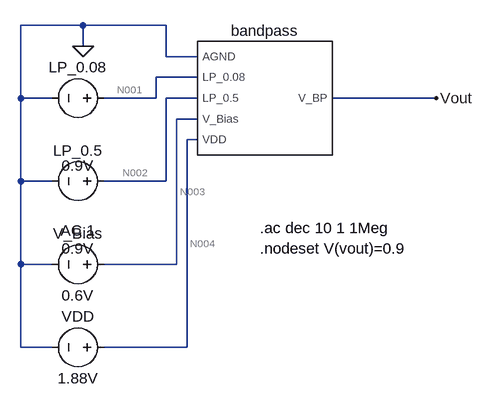
[diagram p0: schematic ota_bandpass_test.asc]
ota_bandpass_test.asc, the LTspice schematic file:
Version 4.1
SHEET 1 880 680
WIRE -64 64 -160 64
WIRE 64 64 -64 64
WIRE -64 96 -64 64
WIRE 64 112 64 64
WIRE 112 112 64 112
WIRE 112 144 48 144
WIRE -160 176 -160 64
WIRE -112 176 -160 176
WIRE 48 176 48 144
WIRE 48 176 -32 176
WIRE 112 176 64 176
WIRE 480 176 320 176
WIRE 112 208 80 208
WIRE 112 240 96 240
WIRE -160 304 -160 176
WIRE -112 304 -160 304
WIRE 64 304 64 176
WIRE 64 304 -32 304
WIRE -160 432 -160 304
WIRE -112 432 -160 432
WIRE 80 432 80 208
WIRE 80 432 -32 432
WIRE -160 560 -160 432
WIRE -112 560 -160 560
WIRE 96 560 96 240
WIRE 96 560 -32 560
FLAG -64 96 0
FLAG 480 176 Vout
SYMBOL ota_bandpass 208 176 R0
SYMATTR InstName bandpass
SYMBOL voltage -16 176 R90
WINDOW 0 -32 56 VBottom 2
WINDOW 3 88 56 VTop 2
WINDOW 123 60 56 VTop 2
WINDOW 39 0 0 Left 0
SYMATTR InstName LP_0.08
SYMATTR Value 0.9V
SYMBOL voltage -16 304 R90
WINDOW 0 -32 56 VBottom 2
WINDOW 3 88 56 VTop 2
WINDOW 123 60 56 VTop 2
WINDOW 39 0 0 Left 0
SYMATTR InstName LP_0.5
SYMATTR Value 0.9V
SYMATTR Value2 AC 1
SYMBOL voltage -16 432 R90
WINDOW 0 -32 56 VBottom 2
WINDOW 3 32 56 VTop 2
SYMATTR InstName V_Bias
SYMATTR Value 0.6V
SYMBOL voltage -16 560 R90
WINDOW 0 -32 56 VBottom 2
WINDOW 3 32 56 VTop 2
SYMATTR InstName VDD
SYMATTR Value 1.88V
TEXT 208 376 Left 2 !.ac dec 10 1 1Meg\n.nodeset V(vout)=0.9

The netlist it stands for:
* ota_bandpass_test.asc
X§bandpass 0 N001 N002 N003 N004 Vout ota_bandpass  ; pins AGND LP_0.08 LP_0.5 V_Bias VDD V_BP
V§LP_0.08 N001 0 0.9V
V§LP_0.5 N002 0 0.9V AC 1
V_Bias N003 0 0.6V
VDD N004 0 1.88V
.ac dec 10 1 1Meg
.nodeset V(vout)=0.9
.backanno
.end

* Results of the author's LTspice run, read from the files saved beside the schematic
* Operating Point, zero values left out:
*   V(n001) = 900 mV
*   V(n002) = 900 mV
*   V(n003) = 600 mV
*   V(n004) = 1.88 V
*   V(vout) = 1.46 V
*   I(VDD) = -204.8 nA
*   Ix(bandpass:agnd) = -204.8 nA
*   Ix(bandpass:vdd) = 204.8 nA